# EAGLE design 2x -- gegensprechanlage (EAGLE 6.1)
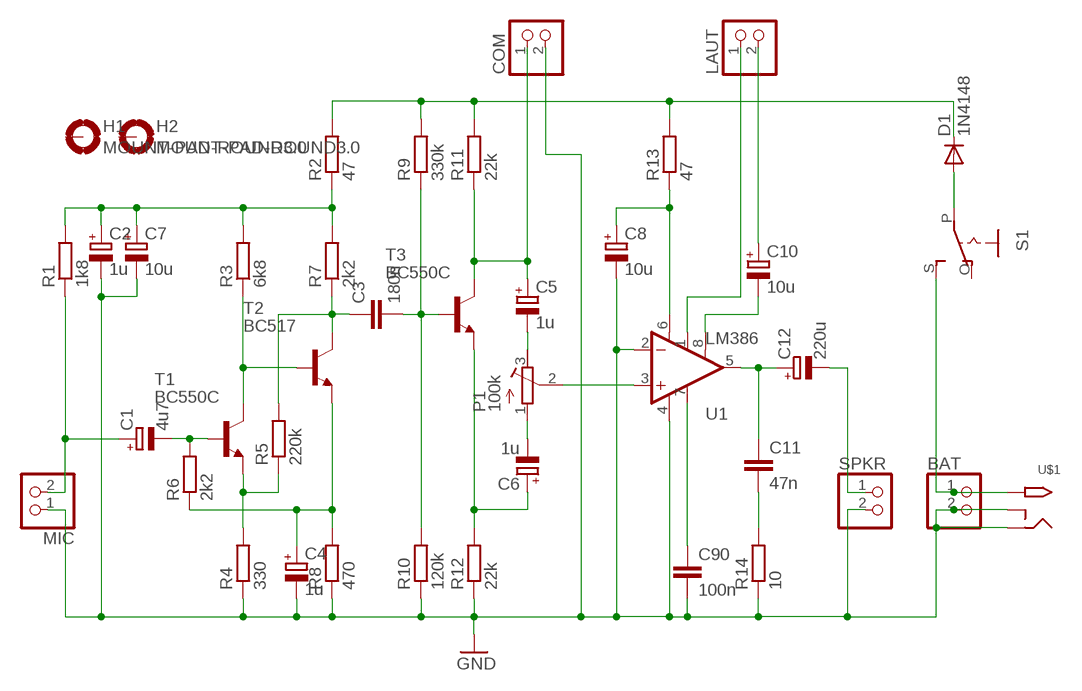
[diagram p0: schematic, sheet 1]

## Parts
BAT  PINHD-1X2  [1X02]
C1  4u7  CPOL-EUE2.5-6  [E2,5-6]
C2  1u  CPOL-EUE2.5-6  [E2,5-6]
C3  180n  C-EU025-025X050  [C025-025X050]
C4  1u  CPOL-EUE2.5-6  [E2,5-6]
C5  1u  CPOL-EUE2.5-6  [E2,5-6]
C6  1u  CPOL-EUE2.5-6  [E2,5-6]
C7  10u  CPOL-EUE2.5-6  [E2,5-6]
C8  10u  CPOL-EUE2.5-6  [E2,5-6]
C10  10u  CPOL-EUE2.5-6  [E2,5-6]
C11  47n  C-EU025-025X050  [C025-025X050]
C12  220u  CPOL-EUE2.5-6  [E2,5-6]
C90  100n  C-EU025-025X050  [C025-025X050]
COM  PINHD-1X2  [1X02]
D1  1N4148  DIODE-D-7.5  [D-7.5]
H1  MOUNT-PAD-ROUND3.0  [3,0-PAD]
H2  MOUNT-PAD-ROUND3.0  [3,0-PAD]
LAUT  PINHD-1X2  [1X02]
MIC  PINHD-1X2  [1X02]
P1  100k  R-TRIMM64P  [RTRIM64P]
R1  1k8  R-EU_0204/7  [0204/7]
R2  47  R-EU_0204/7  [0204/7]
R3  6k8  R-EU_0204/7  [0204/7]
R4  330  R-EU_0204/7  [0204/7]
R5  220k  R-EU_0204/7  [0204/7]
R6  2k2  R-EU_0204/7  [0204/7]
R7  2k2  R-EU_0204/7  [0204/7]
R8  470  R-EU_0204/7  [0204/7]
R9  330k  R-EU_0204/7  [0204/7]
R10  120k  R-EU_0204/7  [0204/7]
R11  22k  R-EU_0204/7  [0204/7]
R12  22k  R-EU_0204/7  [0204/7]
R13  47  R-EU_0204/7  [0204/7]
R14  10  R-EU_0204/7  [0204/7]
S1  EG1218S  [EG1218]
SPKR  PINHD-1X2  [1X02]
T1  BC550C  BC550-NPN-TO92-CBE  [TO92-CBE]
T2  BC517  BC550-NPN-TO92-CBE  [TO92-CBE]
T3  BC550C  BC550-NPN-TO92-CBE  [TO92-CBE]
U1  LM386  [DIP08]
U$1  2.1MMJACKTHM  [PJ-102A]

## Nets
GND: BAT.2 C2.- C4.- C7.- C8.- C90.2 COM.2 MIC.1 R4.1 R8.1 R10.1 R12.1 R14.1 SPKR.2 U1.2(-IN) U1.4(V-) U$1.RING U$1.RING_SW
N$1: C1.- R6.2 T1.B
N$2: C1.+ MIC.2 R1.1
N$3: R3.1 T1.C T2.B
N$4: R4.2 R5.1 T1.E
N$5: C3.1 R5.2 R7.1 T2.C
N$6: C10.+ LAUT.2
N$7: C4.+ R6.1 R8.2 T2.E
N$8: C2.+ C7.+ R1.2 R2.1 R3.2 R7.2
N$9: C3.2 R9.1 R10.2 T3.B
N$10: D1.C R2.2 R9.2 R11.2 R13.2
N$11: C10.- U1.8(GAIN)
N$12: C6.+ R12.2 T3.E
N$13: C6.- P1.1(A)
N$14: P1.2(S) U1.3(+IN)
N$15: C5.+ COM.1 R11.1 T3.C
N$16: C5.- P1.3(E)
N$17: C90.1 U1.7(BP)
N$18: C8.+ R13.1 U1.6(V+)
N$19: LAUT.1 U1.1(GAIN)
N$20: C11.1 C12.+ U1.5(OUT)
N$21: C11.2 R14.2
N$22: C12.- SPKR.1
N$24: BAT.1 S1.S U$1.TIP
N$25: D1.A S1.P
Unconnected: H1.B3,0(MOUNT) H2.B3,0(MOUNT) S1.O

## Library data of the parts
BAT COM LAUT MIC SPKR = pinhead:PINHD-1X2: PIN HEADER
C1 C2 C4-C8 C10 C12 = rcl:CPOL-EU: POLARIZED CAPACITOR, European symbol
C3 C11 C90 = rcl:C-EU: CAPACITOR, European symbol
D1 = diode:DIODE-: DIODE
H1 H2 = holes:MOUNT-PAD-ROUND: MOUNTING PAD, round
P1 = rcl:R-TRIMM: Trimm resistor
R1-R14 = rcl:R-EU_: RESISTOR, European symbol
S1 = _MY_OWN_LIB:EG1218: SLIDING SWITCH 0.1" spacing through hole, vertical SPDT slide switch http://www.ladyada.net/library/pcb/eaglelibrary.html
T1-T3 = transistor:*-NPN-: NPN Transistror BF959 corrected 2008.03.06
U1 = SparkFun-AnalogIC:LM386: low voltage audio power amplifier
U$1 = adafruit:2.1MMJACK: 2.1mm x 5.5mm THM DC jack with internal switch. Digikey part #PJ-102A, 4UCON part #05537 2.1mm x 5.5mm SMT DC jack with internal switch. Digikey part #PJ-002A-SMT, 4UCON part #03267 By microbuilder.eu & adafruit.com

## Board
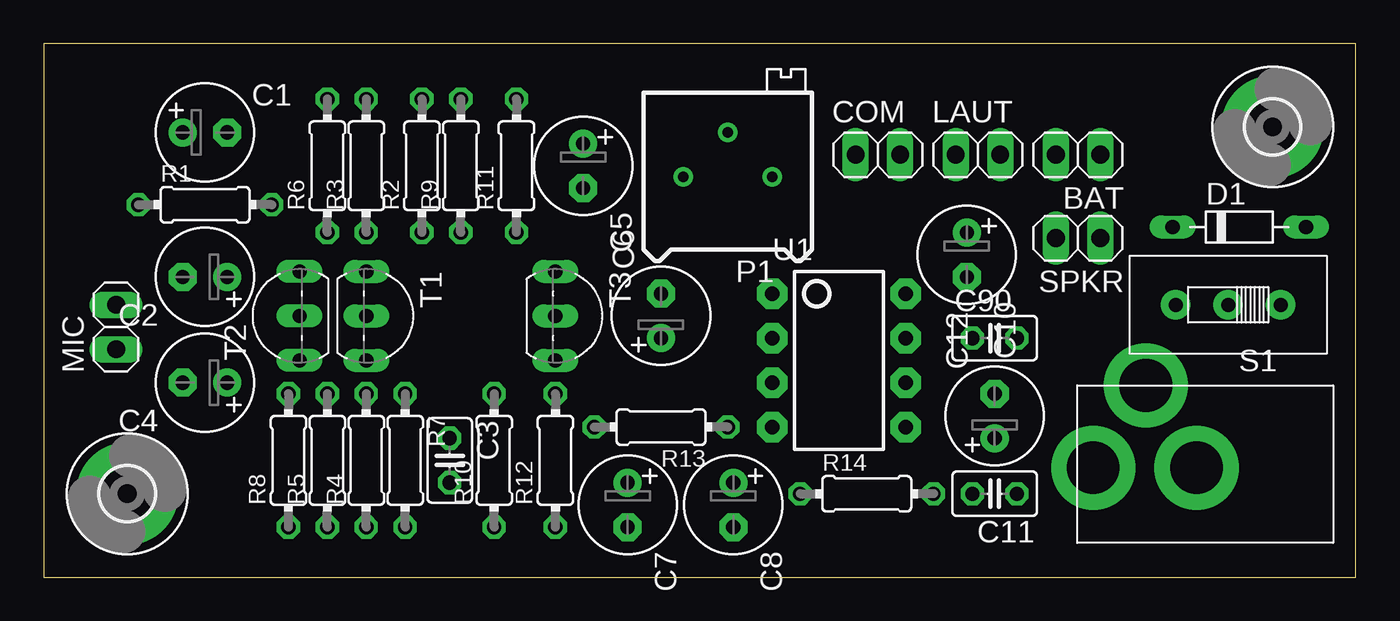
[diagram p1: board, top side]
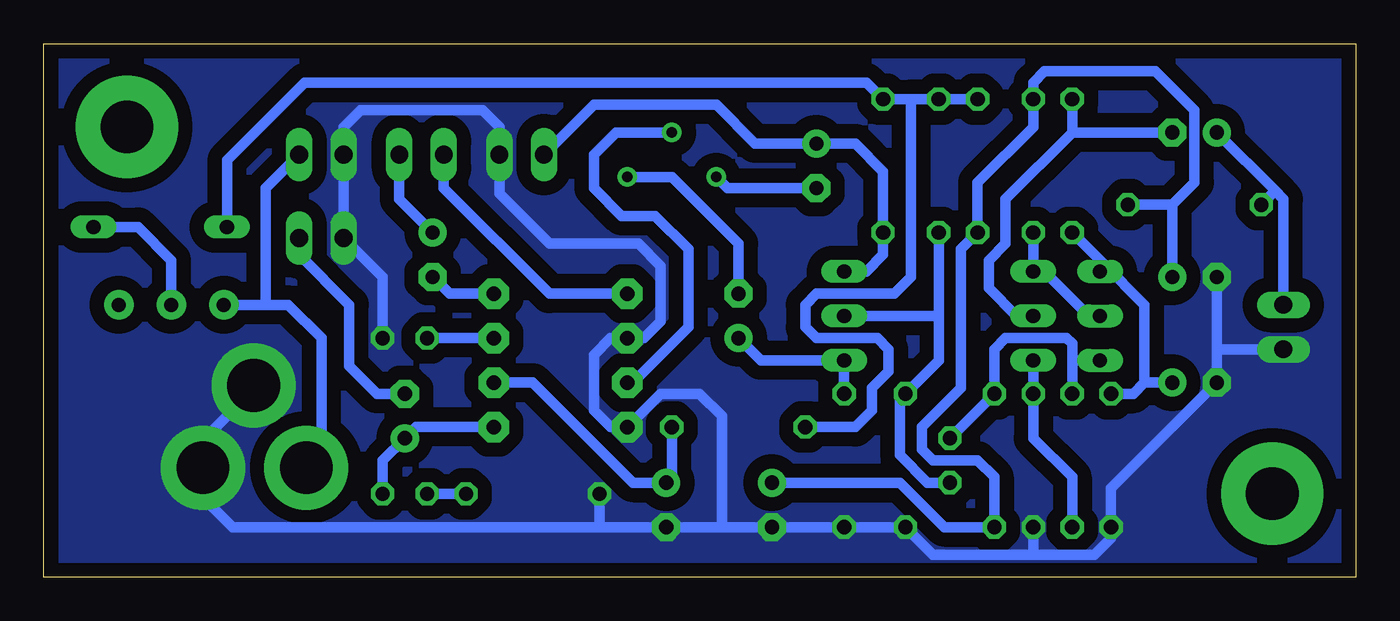
[diagram p2: board, bottom side, seen from below]

Size 74.91 x 30.47 mm. Coordinates in mm from the lower left corner, seen from the top.
Outline: 0,0 74.91,0 74.91,30.47 0,30.47 0,0
Copper layers (1*16): Top 0.035mm / dielectric 1.5mm / Bottom 0.035mm
Design rules: minimum track width 10mil, minimum drill 24mil, track to track 12mil, track to pad 12mil, pad to pad 12mil, via to via 12mil, smd to smd 10mil, copper to edge 12mil, drill to drill 12mil, minimum pad ring 10mil, minimum via ring 10mil, stop-mask expansion 4mil, vias tented up to drill 0mil, thermal gap 12mil

### Footprints (pad centres in the part's own frame; a part is rotated, then mirrored left to right if it is on the bottom)
1X02 = drill 1.016 long: 1 -1.27,0; 2 1.27,0
E2,5-6 = drill 0.813 pad 1.6: + -1.27,0 | drill 0.813 pad 1.6 octagon: - 1.27,0
C025-025X050 = drill 0.813 octagon: 1 -1.27,0; 2 1.27,0
D-7.5 = drill 0.813 long: A 3.81,0; C -3.81,0
3,0-PAD = drill 3 pad 5.842: B3,0 0,0
RTRIM64P = drill 0.61: 1 0,-2.54; 2 2.54,0; 3 0,2.54
0204/7 = drill 0.813 octagon: 1 -3.81,0; 2 3.81,0
EG1218 = drill 0.8 pad 1.676: O -3,0; P 0,0; S 3,0
TO92-CBE = drill 0.813 long: B 0,0; C -2.54,0; E 2.54,0
DIP08 = drill 0.813 pad 1.727 octagon: 1 -3.81,-3.81; 2 -1.27,-3.81; 3 1.27,-3.81; 4 3.81,-3.81; 5 3.81,3.81; 6 1.27,3.81; 7 -1.27,3.81; 8 -3.81,3.81
PJ-102A = drill 3 pad 4.8: RING 0.1,-3.39; RING_SW -4.6,-6.29; TIP 0.1,-9.29

### Placement (x,y rotation side)
BAT  59.05,24.13 180 top
C1  9.21,25.4 0 top
C2  9.21,17.14 180 top
C3  23.18,6.67 270 top
C4  9.21,11.11 180 top
C5  30.8,23.5 270 top
C6  35.24,14.92 90 top
C7  33.34,4.13 270 top
C8  39.37,4.13 270 top
C10  52.7,18.41 270 top
C11  54.29,4.76 180 top
C12  54.29,9.21 90 top
C90  54.29,13.65 0 top
COM  47.62,24.13 0 top
D1  68.26,20 0 top
H1  70.17,25.72 0 top
H2  4.76,4.76 0 top
LAUT  53.34,24.13 0 top
MIC  4.13,14.29 90 top
P1  39.05,22.86 90 top
R1  9.21,21.27 0 top
R2  21.59,23.5 90 top
R3  18.41,23.5 90 top
R4  18.41,6.67 90 top
R5  16.19,6.67 90 top
R6  16.19,23.5 90 top
R7  20.64,6.67 270 top
R8  13.97,6.67 90 top
R9  23.81,23.5 90 top
R10  25.72,6.67 90 top
R11  26.99,23.5 90 top
R12  29.21,6.67 90 top
R13  35.24,8.57 180 top
R14  46.99,4.76 0 top
S1  67.63,15.56 180 top
SPKR  59.05,19.37 180 top
T1  18.41,14.92 270 top
T2  14.61,14.92 90 top
T3  29.21,14.92 270 top
U1  45.4,12.38 270 top
U$1  69.22,6.35 270 top

### Tracks (layer width: path | path; a pad name or v marks a point on that pad's centre or on a via)
GND
  Bottom 0.61: R4.1 18.41,1.27 | 18.41,1.27 24.13,1.27 R10.1 R12.1 C7.- | 32.7,2.86 C7.- | C7.- 36.2,2.86 | 36.2,2.86 C8.- 43.18,2.86 | 36.2,2.86 36.2,9.21 37.47,10.48 39.69,10.48 U1.4 42.55,8.57 43.5,9.53 43.5,12.7 42.55,13.65 U1.2 40.64,13.65 39.69,14.61 39.69,17.78 40.96,19.05 46.04,19.05 48.9,21.91 COM.2 48.9,25.72 49.85,26.67 56.83,26.67 57.78,25.72 BAT.2 SPKR.2 55.56,17.14 C90.2 | R14.1 43.18,2.86 | 18.41,1.27 14.92,1.27 13.97,2.22 13.97,5.08 C4.- 7.94,13.02 | 43.18,2.86 64.14,2.86 65.72,4.45 65.72,7.94 62.55,11.11 | C2.- 7.94,13.02 | MIC.1 7.94,13.02
  pour Bottom (isolate 0.813, no thermals): 0.95,0.95 73.98,0.95 73.98,29.53 0.95,29.53
N$1
  Bottom 0.61: T1.B 19.37,14.92 20.95,16.51 20.95,18.1 20,19.05 20,21.59 16.19,25.4 | R6.2 16.19,25.4 | C1.- 16.19,25.4
N$2
  Bottom 0.61: MIC.2 4.13,21.59 4.6,22.07 | 4.6,22.07 C1.+ | R1.1 4.6,22.07
N$3
  Bottom 0.61: R3.1 T1.C 17.78,17.46 15.24,14.92 T2.B
N$4
  Bottom 0.61: T1.E R4.2 18.41,7.94 16.19,5.71 R5.1
N$5
  Bottom 0.61: C3.1 R7.1 20.64,13.02 20,13.65 16.51,13.65 16.19,13.34 16.19,12.38 | 16.19,12.38 R5.2 | T2.C 16.19,12.38
N$6
  Bottom 0.61: LAUT.2 54.61,21.59 C10.+
N$7
  Bottom 0.61: 14.45,17.94 12.06,15.56 12.06,11.11 | 14.45,17.94 R6.1 | T2.E 14.45,17.94 | 12.06,11.11 C4.+ | R8.2 12.7,10.48 12.06,11.11
N$8
  Bottom 0.61: C7.+ 26.04,5.4 23.5,2.86 R7.2 20.64,5.71 21.59,6.67 24.13,6.67 24.77,7.3 24.77,8.57 22.54,10.79 22.54,18.73 R2.1 21.59,22.54 18.41,25.72 R3.2 18.41,28.26 17.78,28.89 11.43,28.89 9.21,26.67 9.21,22.54 10.48,21.27 | C2.+ 10.48,21.27 | R1.2 10.48,21.27
N$9
  Bottom 0.61: 23.81,14.92 T3.B | R9.1 23.81,14.92 | 23.81,14.92 23.81,12.38 R10.2 26.04,10.16 26.04,6.99 24.45,5.4 C3.2
N$10
  Bottom 0.61: R2.2 R9.2 25.4,27.3 | 25.4,27.3 R11.2 27.94,28.26 60.01,28.26 64.45,23.81 D1.C | 25.4,27.3 25.4,17.14 26.35,16.19 30.8,16.19 31.43,15.56 31.43,14.29 30.8,13.65 27.3,13.65 26.67,13.02 26.67,11.75 27.62,10.79 27.62,9.53 28.57,8.57 R13.2
N$11
  Bottom 0.61: U1.8 51.75,16.19 C10.-
N$12
  Bottom 0.61: C6.+ 33.97,12.38 T3.E R12.2
N$13
  Bottom 0.61: C6.- 35.24,19.05 39.05,22.86 P1.1
N$14
  Bottom 0.61: U1.3 41.27,11.11 38.1,14.29 38.1,18.73 40.01,20.64 41.91,20.64 43.5,22.23 43.5,24.13 42.23,25.4 P1.2
N$15
  Bottom 0.61: T3.C 27.94,17.46 26.99,18.41 R11.1 26.99,23.18 28.57,24.77 C5.+ 34.29,24.77 36.51,26.99 43.5,26.99 COM.1
N$16
  Bottom 0.61: C5.- 35.88,22.23 P1.3
N$17
  Bottom 0.61: U1.7 C90.1
N$18
  Bottom 0.61: R13.1 39.05,5.71 C8.+ 41.27,5.4 46.99,11.11 U1.6
N$19
  Bottom 0.61: U1.1 46.04,16.19 52.07,22.23 LAUT.1
N$20
  Bottom 0.61: U1.5 53.66,8.57 C12.+ 55.56,6.67 C11.1
N$21
  Bottom 0.61: R14.2 C11.2
N$22
  Bottom 0.61: C12.- 55.88,10.48 57.47,12.06 57.47,15.56 60.33,18.41 SPKR.1
N$24
  Bottom 0.61: U$1.TIP 59.47,6.57 59.05,6.99 59.05,13.65 60.96,15.56 62.23,15.56 | 62.23,15.56 S1.S | BAT.1 62.23,22.23 62.23,15.56
N$25
  Bottom 0.61: D1.A 69.53,20 67.63,18.1 S1.P